# EAGLE design LEDjets (EAGLE 9.6.0)
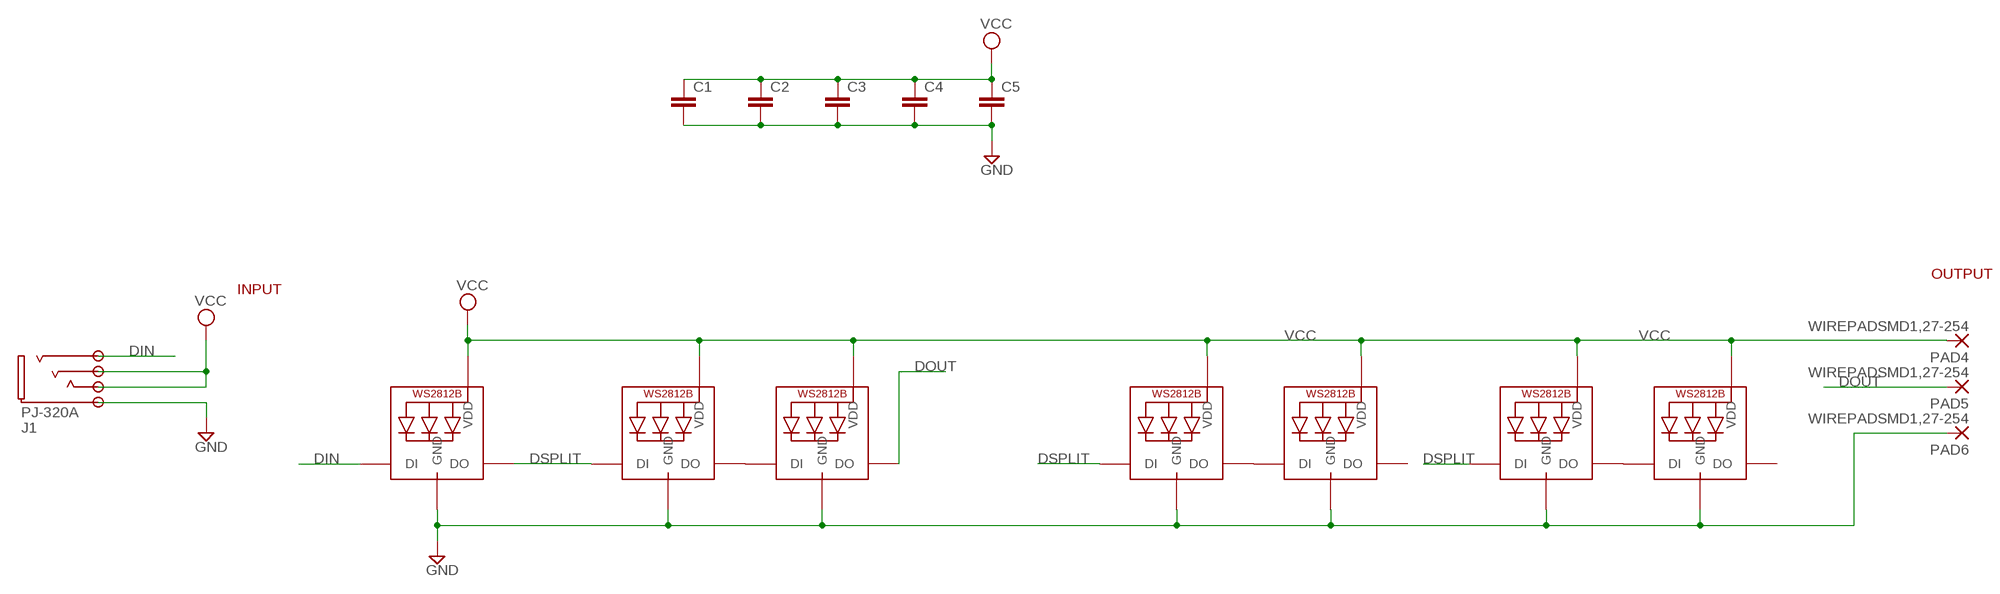
[diagram p0: schematic, sheet 1]

## Parts
C1  C-EUC0805K  [C0805K]
C2  C-EUC0805K  [C0805K]
C3  C-EUC0805K  [C0805K]
C4  C-EUC0805K  [C0805K]
C5  C-EUC0805K  [C0805K]
J1  PJ-320A  [PJ-320A]
LED1  WS2812B5050  [WS2812B]
LED2  WS2812B5050  [WS2812B]
LED3  WS2812B5050  [WS2812B]
LED4  WS2812B5050  [WS2812B]
LED5  WS2812B5050  [WS2812B]
LED6  WS2812B5050  [WS2812B]
LED7  WS2812B5050  [WS2812B]
PAD4  WIREPADSMD1,27-254  [SMD1,27-2,54]
PAD5  WIREPADSMD1,27-254  [SMD1,27-2,54]
PAD6  WIREPADSMD1,27-254  [SMD1,27-2,54]

## Nets
DIN: J1.2 LED1.4-DIN(DI)
DOUT: LED3.2-DOUT(DO) PAD5.1(P)
DSPLIT: LED1.2-DOUT(DO) LED2.4-DIN(DI) LED4.4-DIN(DI) LED6.4-DIN(DI)
GND: C1.2 C2.2 C3.2 C4.2 C5.2 J1.5 LED1.3-GND(GND) LED2.3-GND(GND) LED3.3-GND(GND) LED4.3-GND(GND) LED5.3-GND(GND) LED6.3-GND(GND) LED7.3-GND(GND) PAD6.1(P)
N$2: LED2.2-DOUT(DO) LED3.4-DIN(DI)
N$4: LED4.2-DOUT(DO) LED5.4-DIN(DI)
N$6: LED6.2-DOUT(DO) LED7.4-DIN(DI)
VCC: C1.1 C2.1 C3.1 C4.1 C5.1 J1.3 J1.4 LED1.1-VDD(VDD) LED2.1-VDD(VDD) LED3.1-VDD(VDD) LED4.1-VDD(VDD) LED5.1-VDD(VDD) LED6.1-VDD(VDD) LED7.1-VDD(VDD) PAD4.1(P)
Unconnected: LED5.2-DOUT(DO) LED7.2-DOUT(DO)

## Notes on the sheet
- OUTPUT
- INPUT

## Library data of the parts
C1-C5 = rcl:C-EU: CAPACITOR, European symbol; SPICEPREFIX: C
J1 = parts:PJ-320A
LED1-LED7 = adafruit:WS2812B
PAD4-PAD6 = wirepad:WIREPAD: Wire PAD connect wire on PCB

## Board
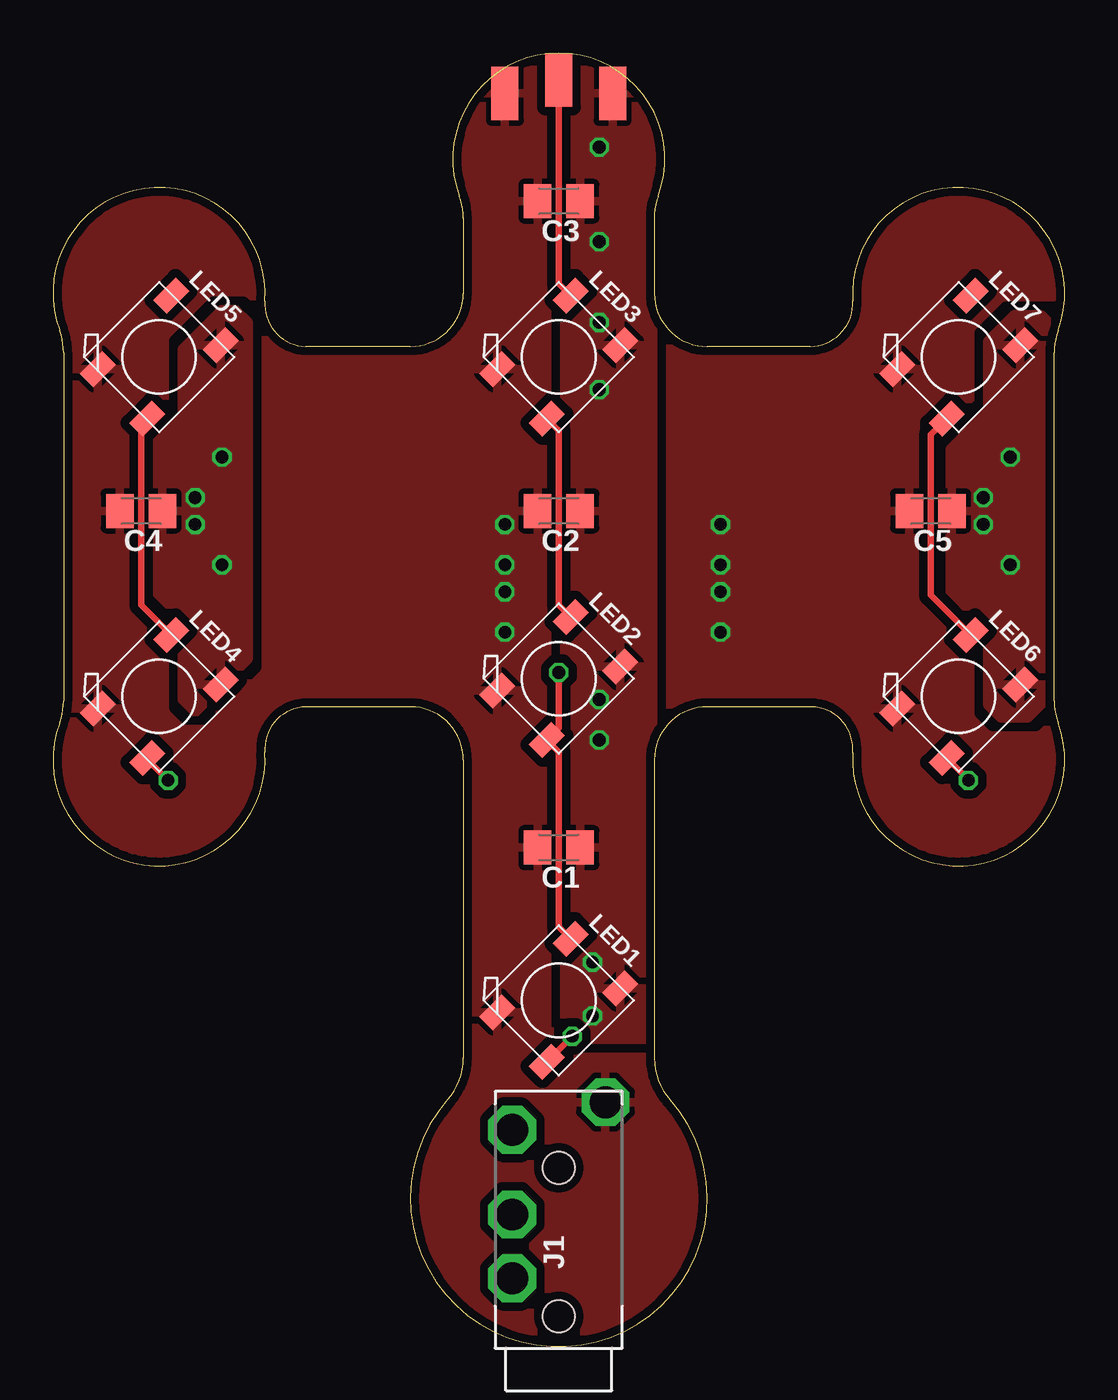
[diagram p1: board, top side]
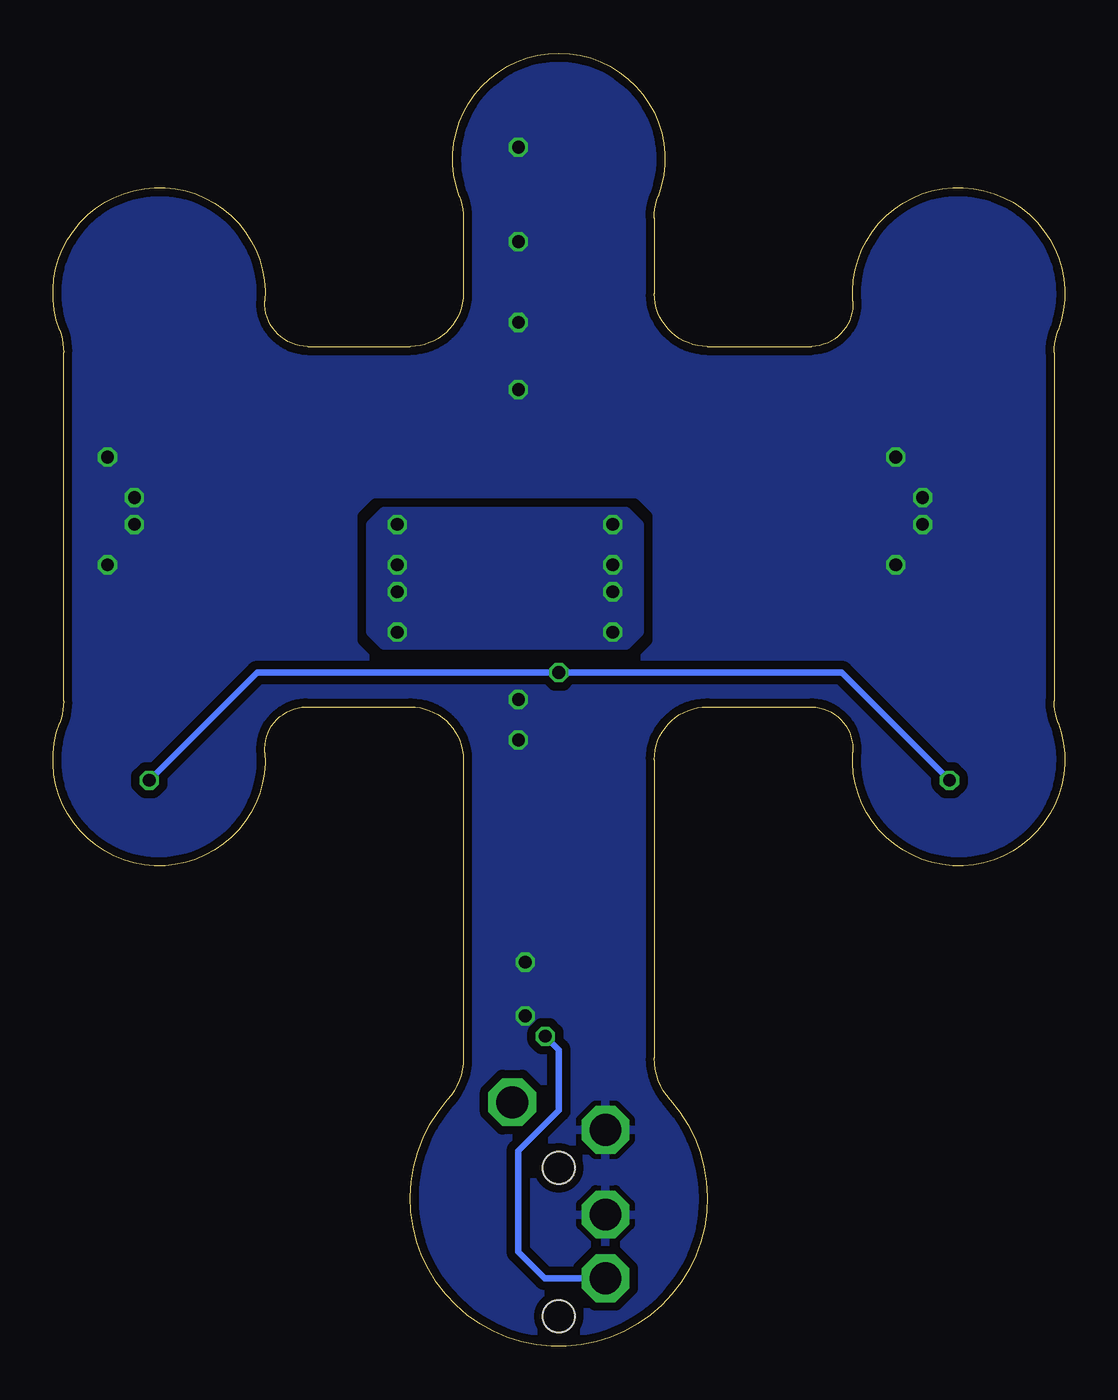
[diagram p2: board, bottom side, seen from below]

Size 47.68 x 60.98 mm. Coordinates in mm from the lower left corner, seen from the top.
Outline: 28.34,53.2 28.34,49.65 arc90 30.84,47.15 35.68,47.15 arc92 37.69,49.29 arc-204 47.37,47.91 arc20 47.18,46.87 47.18,30.44 arc20 47.37,29.4 arc-204 37.69,28.02 arc92 35.77,30.16 30.84,30.16 arc90 28.34,27.66 28.34,13.6 arc41 29.09,11.62 arc-263 18.59,11.62 arc41 19.34,13.6 19.34,27.66 arc90 16.84,30.16 11.91,30.16 arc92 9.98,28.02 arc-204 0.31,29.4 arc20 0.5,30.44 0.5,46.87 arc20 0.31,47.91 arc-204 9.98,49.29 arc92 11.91,47.15 16.84,47.15 arc90 19.34,49.65 19.34,53.2 arc20 19.15,54.24 arc-221 28.53,54.24 arc20 28.34,53.2
Copper layers (1*16): Top 0.035559375mm / dielectric 1.6mm / Bottom 0.035559375mm
Design rules "jlcpcb2layer": minimum track width 5mil, minimum drill 8mil, track to track 5mil, track to pad 5mil, pad to pad 20mil, via to via 10mil, smd to smd 5mil, copper to edge 8mil, drill to drill 20mil, minimum pad ring 12mil, minimum via ring 5mil, stop-mask expansion 2.5mil, vias tented up to drill 20mil, thermal gap 10mil

### Footprints (pad centres in the part's own frame; a part is rotated, then mirrored left to right if it is on the bottom)
C0805K = smd 1.3 x 1.6: 1 -1,0; 2 1,0
PJ-320A = drill 1.5 octagon: 2 3.3,2.2; 3 6.3,2.2; 4 10.3,2.2; 5 11.6,-2.2 | hole 1.5: 1.5,0; 8.5,0
WS2812B = smd 1.5 x 0.9: 1-VDD 2.45,-1.65; 2-DOUT 2.45,1.65; 3-GND -2.45,1.65; 4-DIN -2.45,-1.65
SMD1,27-2,54 = smd 1.27 x 2.54: 1 0,0

### Placement (x,y rotation side)
C1  23.84,23.52 180 top
C2  23.84,39.39 180 top
C3  23.84,54 180 top
C4  4.15,39.39 180 top
C5  41.36,39.39 180 top
J1  23.84,-0.08 90 top
LED1  23.84,16.32 45 top
LED2  23.84,31.49 45 top
LED3  23.84,46.66 45 top
LED4  5,30.66 45 top
LED5  5,46.66 45 top
LED6  42.68,30.66 45 top
LED7  42.68,46.66 45 top
PAD4  26.38,59.08 0 top
PAD5  23.84,59.71 0 top
PAD6  21.3,59.08 0 top

### Tracks (layer width: path | path; a pad name or v marks a point on that pad's centre or on a via)
DIN  (via drill 0.6)
  Top 0.305: LED1.4-DIN 24.47,14.62 v24.47,14.63
  Bottom 0.305: v24.47,14.63 23.84,13.99 23.84,11.14 25.74,9.23 25.74,4.46 24.5,3.22 J1.2
DOUT
  Top 0.305: LED3.2-DOUT 23.84,50.12 PAD5.1
DSPLIT  (via drill 0.6)
  Top 0.305: LED1.2-DOUT 23.84,19.78 23.84,28.02 LED2.4-DIN 23.84,29.15 v23.84,31.77 | v5.42,26.69 4.43,27.69 LED4.4-DIN | v43.14,26.69 43.14,26.73 LED6.4-DIN
  Bottom 0.305: v5.42,26.69 10.5,31.77 v23.84,31.77 38.06,31.77 v43.14,26.69
GND  (via drill 0.6)
  other vias: 31.46,38.76 31.46,36.85 31.46,35.58 31.46,33.68 21.3,38.76 21.3,36.85 21.3,35.58 21.3,33.68
  pour Top (isolate 0.406, rank 2): 9.98,49.29 arc204 0.31,47.91 arc-20 0.5,46.87 0.5,30.44 arc-20 0.31,29.4 arc204 9.98,28.02 arc-92 11.91,30.16 16.84,30.16 arc-90 19.34,27.66 15.53,3.29 16.79,-1.15 34.05,-8.77 28.34,27.66 arc-90 30.84,30.16 35.77,30.16 arc-92 37.69,28.02 arc204 47.37,29.4 arc-20 47.18,30.44 47.18,46.87 arc-20 47.37,47.91 arc204 37.69,49.29 arc-92 35.68,47.15 30.84,47.15 arc-90 28.34,49.65 28.34,53.2 arc-20 28.53,54.24 arc221 19.15,54.24 arc-20 19.34,53.2 19.34,49.65 arc-90 16.84,47.15 11.91,47.15 arc-92
  pour Bottom (isolate 0.406): 20.66,39.39 20.03,38.76 20.03,33.68 20.66,33.04 32.09,33.04 32.73,33.68 32.73,38.76 32.09,39.39
N$2
  Top 0.305: LED2.2-DOUT 23.84,34.95 23.84,43.19 LED3.4-DIN
N$4
  Top 0.305: LED5.4-DIN 4.15,43.48 4.15,34.96 LED4.2-DOUT
N$6
  Top 0.305: LED7.4-DIN 41.36,43.01 41.36,35.44 LED6.2-DOUT
VCC  (via drill 0.6)
  other vias: 25.43,18.12 25.43,15.58 25.74,48.28 25.74,45.11 25.74,56.54 25.74,52.09 43.84,38.76 43.84,40.03 45.11,41.93 45.11,36.85 7.96,41.93 6.69,40.03 6.69,38.76 7.96,36.85 25.74,28.6 25.74,30.5
  pour Top (isolate 0.406): 24.09,14.45 24.09,60.98 27.01,60.98 28.28,59.71 28.28,14.45
  pour Top (isolate 0.406): 7.96,48.92 6.06,47.01 6.06,43.84 4.15,41.93 4.15,36.22 6.06,34.31 6.06,30.5 6.69,29.87 9.23,32.41 9.23,48.28 8.6,48.92
  pour Top (isolate 0.406): 45.3,48.67 44.03,47.4 44.03,44.09 42.25,42.32 42.25,35.58 44.03,33.81 44.03,30.25 44.67,29.62 45.94,29.62 47.21,30.89 47.21,48.03 46.57,48.67
  pour Bottom (isolate 0.406, rank 2): 9.98,49.29 arc204 0.31,47.91 arc-20 0.5,46.87 0.5,30.44 arc-20 0.31,29.4 arc204 9.98,28.02 arc-92 11.91,30.16 16.84,30.16 arc-90 19.34,27.66 19.34,13.08 16.68,11.06 16.68,-0.1 30.84,-0.1 30.84,9.98 28.34,13.28 28.34,27.66 arc-90 30.84,30.16 35.77,30.16 arc-92 37.69,28.02 arc204 47.37,29.4 arc-20 47.18,30.44 47.18,46.87 arc-20 47.37,47.91 arc204 37.69,49.29 arc-92 35.68,47.15 30.84,47.15 arc-90 28.34,49.65 28.34,53.2 arc-20 28.53,54.24 arc221 19.15,54.24 arc-20 19.34,53.2 19.34,49.65 arc-90 16.84,47.15 11.91,47.15 arc-92

### Text on the board
tTest: GND | DOUT | 5V | GND | 5V | DIN